# EAGLE design receiver (EAGLE 6.6.0)
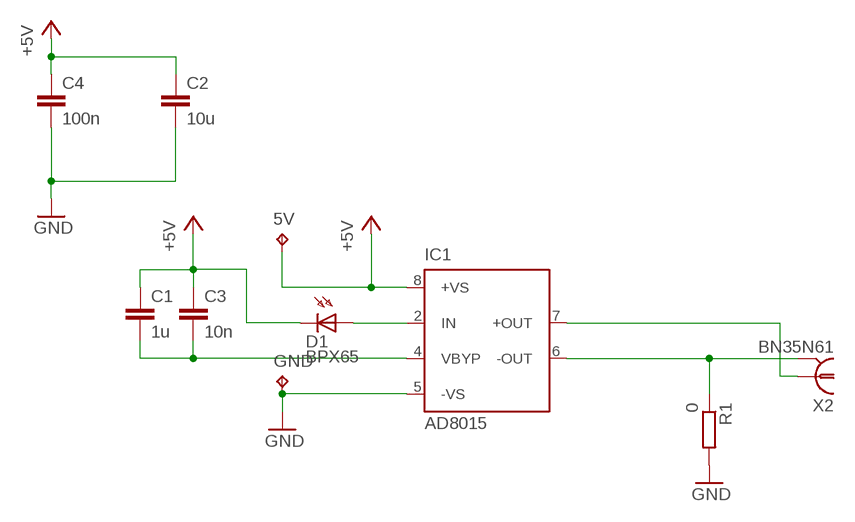
[diagram p0: schematic, sheet 1]

## Parts
5V  TPTP20SQ  [TP20SQ]
C1  1u  C-EUC1206  [C1206]
C2  10u  C-EUC1206  [C1206]
C3  10n  C-EUC0603  [C0603]
C4  100n  C-EUC0603  [C0603]
D1  BPX65  [BPX65]
GND  TPTP20SQ  [TP20SQ]
IC1  AD8015  [SO8]
R1  0  R-EU_R1206  [R1206]
X2  BN35N61  [B35N61]

## Nets
+5V: 5V.TP C1.1 C2.1 C3.1 C4.1 D1.K(C) IC1.8(+VS)
GND: C2.2 C4.2 GND.TP IC1.5(-VS) R1.2
N$3: C1.2 C3.2 IC1.4(VBYP)
N$4: IC1.7(+OUT) X2.1
N$5: IC1.6(-OUT) R1.1 X2.2 X2.3 X2.4 X2.5
N$8: D1.A IC1.2(IN)

## Library data of the parts
5V GND = testpad:TP: Test pad
C1-C4 = resistor:C-EU: CAPACITOR, European symbol
D1 = opto-trans-siemens:BPX65: PHOTO DIODE; MPN: BPX65.; OC_FARNELL: 327451; OC_NEWARK: 06WX2764
IC1 = analog-devices:AD8015: Wideband/Differential Output Transimpedance Amplifier Source: http://www.analog.com/static/imported-files/data_sheets/AD8015.pdf; MPN: AD8015ARZ; OC_FARNELL: 1464812; OC_NEWARK: 19M8870
R1 = resistor:R-EU_: RESISTOR, European symbol
X2 = con-coax:BN35N61: BNC CONNECTOR M/A COM www.macom.com distributor Farnell 149-452; OC_FARNELL: unknown; OC_NEWARK: unknown

## Board
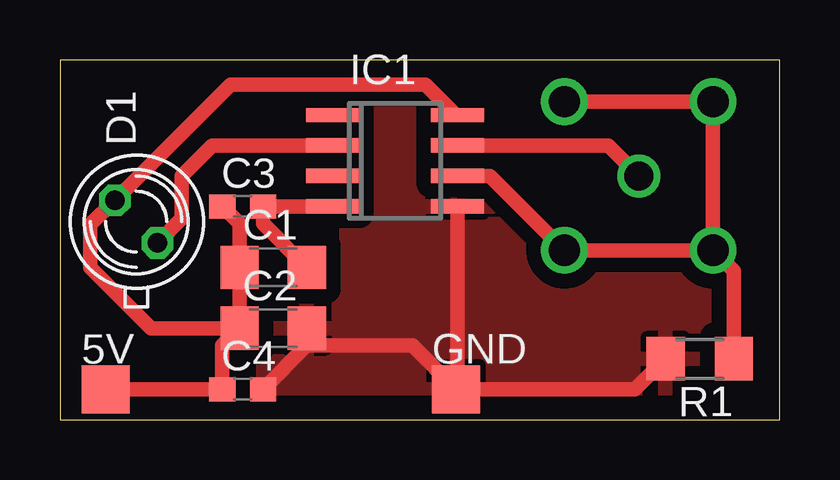
[diagram p1: board, top side]
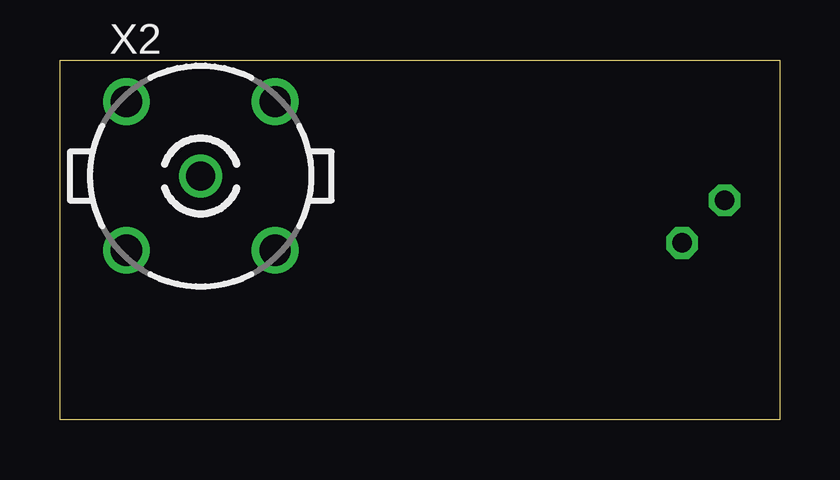
[diagram p2: board, bottom side, seen from below]

Size 30 x 15 mm. Coordinates in mm from the lower left corner, seen from the top.
Outline: 0,0 30,0 30,15 0,15 0,0
Copper layers (1*16): Top 0.035mm / dielectric 1.5mm / Bottom 0.035mm
Design rules "default": minimum track width 10mil, minimum drill 24mil, track to track 8mil, track to pad 8mil, pad to pad 8mil, via to via 8mil, smd to smd 8mil, copper to edge 40mil, drill to drill 8mil, minimum pad ring 10mil, minimum via ring 8mil, stop-mask expansion 4mil, vias tented up to drill 0mil, thermal gap 10mil

### Footprints (pad centres in the part's own frame; a part is rotated, then mirrored left to right if it is on the bottom)
TP20SQ = smd 2 x 2: TP 0,0
C1206 = smd 1.6 x 1.8: 1 -1.4,0; 2 1.4,0
C0603 = smd 1.1 x 1: 1 -0.85,0; 2 0.85,0
BPX65 = drill 0.813 octagon: A -0.889,-0.889; K 0.889,0.889
SO8 = smd 0.6 x 2.2: 1 -1.905,-2.6; 2 -0.635,-2.6; 3 0.635,-2.6; 4 1.905,-2.6; 5 1.905,2.6; 6 0.635,2.6; 7 -0.635,2.6; 8 -1.905,2.6
R1206 = smd 1.6 x 1.803: 1 -1.422,0; 2 1.422,0
B35N61 = drill 1.2: 1 0,0 | drill 1.3: 2 3.099,3.099; 3 -3.099,3.099; 4 -3.099,-3.099; 5 3.099,-3.099

### Placement (x,y rotation side)
5V  1.91,1.27 0 top
C1  8.89,6.35 0 top
C2  8.89,3.81 0 top
C3  7.62,8.89 0 top
C4  7.62,1.27 0 top
D1  3.17,8.26 90 top
GND  16.51,1.27 0 top
IC1  13.97,10.79 270 top
R1  26.67,2.54 180 top
X2  24.13,10.16 0 bottom

### Tracks (layer width: path | path; a pad name or v marks a point on that pad's centre or on a via)
+5V
  Top 0.61: 5V.TP C4.1 6.77,3.09 C2.1 | C2.1 3.81,3.81 1.27,6.35 1.27,8.13 D1.K 7.11,13.97 15.24,13.97 16.51,12.7 IC1.8 | C2.1 C1.1 7.49,8.17 C3.1
GND
  Top 0.61: C2.2 10.29,3.09 | 10.29,3.09 C4.2 | 10.29,3.09 14.69,3.09 GND.TP | GND.TP 23.98,1.27 R1.2 | IC1.5 16.57,1.33 GND.TP
  pour Top (isolate 0.61): 0,15.24 30.48,15.24 30.48,0 0,0
N$3
  Top 0.61: C1.2 8.47,8.17 C3.2 IC1.4
N$4
  Top 0.61: IC1.7 22.86,11.43 X2.1
N$5
  Top 0.61: R1.1 28.09,6.2 X2.4 | X2.4 X2.5 17.93,10.16 IC1.6 | X2.4 X2.3 X2.2
N$8
  Top 0.61: D1.A 5.08,8.38 5.08,10.16 6.35,11.43 IC1.2